# EAGLE design Main_backup1 (EAGLE 7.2.0)
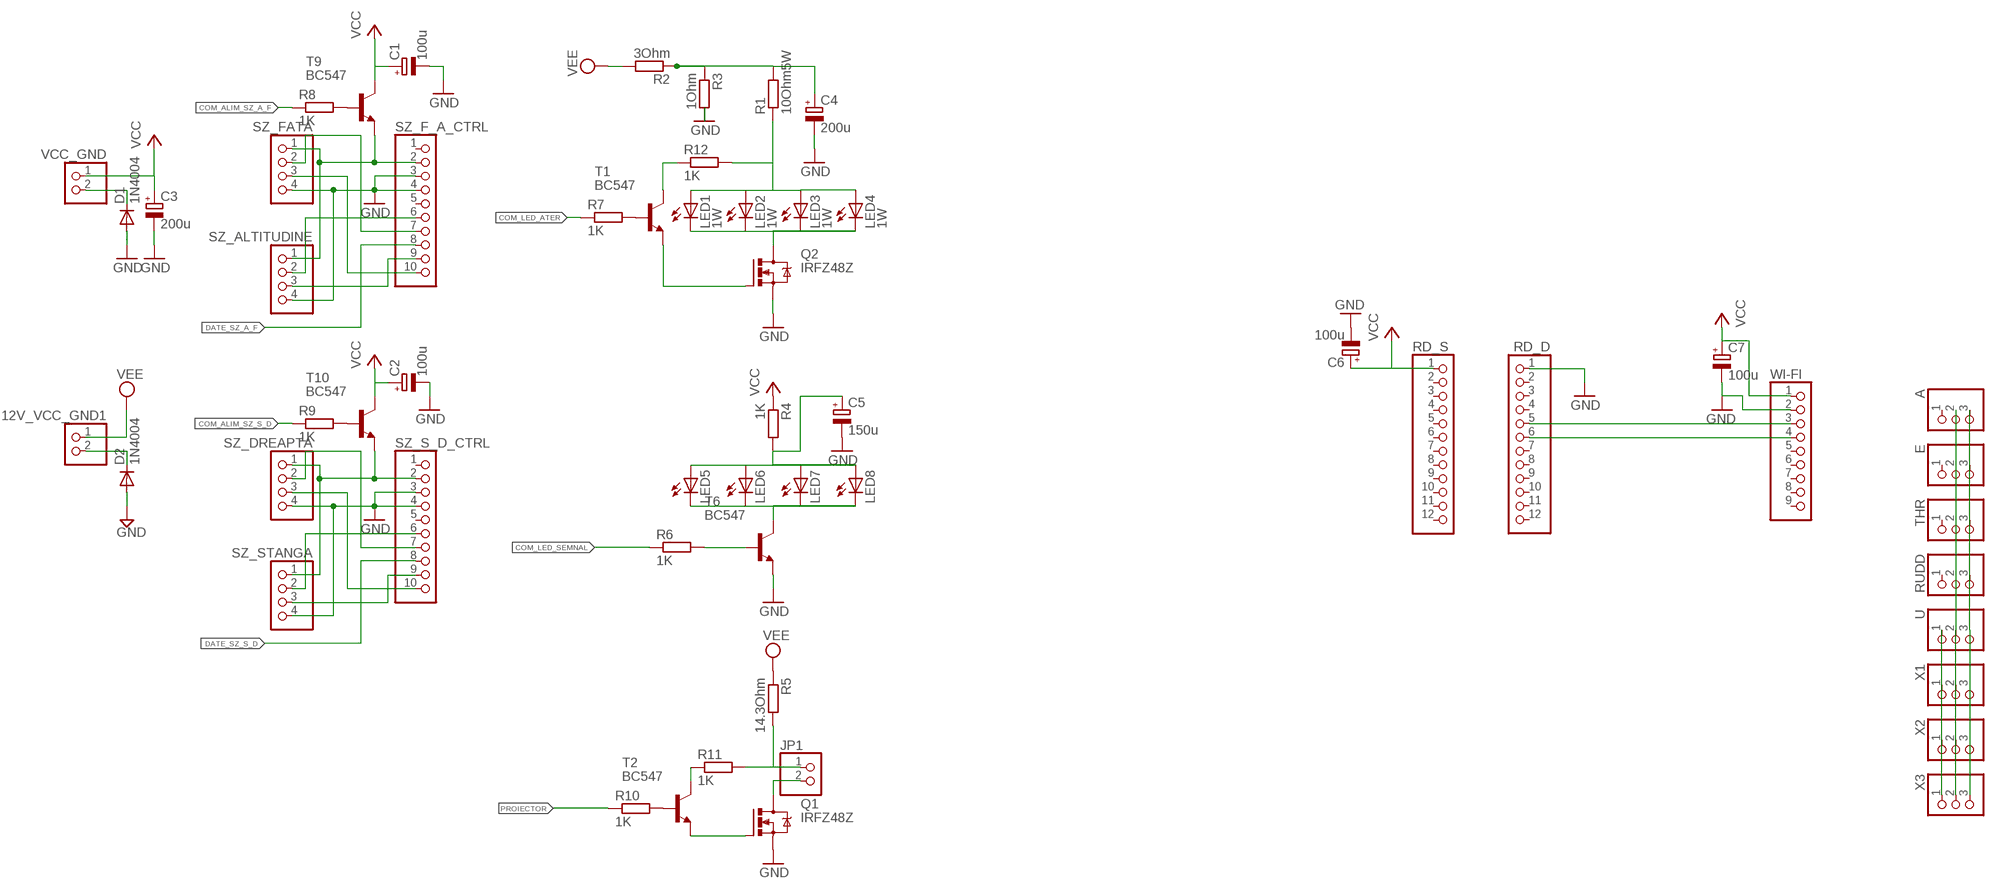
[diagram p0: schematic, sheet 1]

## Parts
12V_VCC_GND1  PINHD-1X2  [1X02]
A  PINHD-1X3/90  [1X03/90]
C1  100u  CPOL-EUE2-5  [E2-5]
C2  100u  CPOL-EUE2-5  [E2-5]
C3  200u  CPOL-EUE2-5  [E2-5]
C4  200u  CPOL-EUE2-5  [E2-5]
C5  150u  CPOL-EUE2-5  [E2-5]
C6  100u  CPOL-EUE2-5  [E2-5]
C7  100u  CPOL-EUE2-5  [E2-5]
D1  1N4004  [DO41-10]
D2  1N4004  [DO41-10]
E  PINHD-1X3/90  [1X03/90]
JP1  PINHD-1X2  [1X02]
LED1  1W  LEDSIDELED  [OSRAM-SIDELED]
LED2  1W  LEDSIDELED  [OSRAM-SIDELED]
LED3  1W  LEDSIDELED  [OSRAM-SIDELED]
LED4  1W  LEDSIDELED  [OSRAM-SIDELED]
LED5  LED5MM  [LED5MM]
LED6  LED5MM  [LED5MM]
LED7  LED5MM  [LED5MM]
LED8  LED5MM  [LED5MM]
Q1  IRFZ48Z  [TO220BH]
Q2  IRFZ48Z  [TO220BH]
R1  10Ohm5W  R-EU_0309/12  [0309/12]
R2  3Ohm  R-EU_0309/12  [0309/12]
R3  1Ohm  R-EU_0309/12  [0309/12]
R4  1K  R-EU_0309/12  [0309/12]
R5  14.3Ohm  R-EU_0309/12  [0309/12]
R6  1K  R-EU_0309/12  [0309/12]
R7  1K  R-EU_0309/12  [0309/12]
R8  1K  R-EU_0309/12  [0309/12]
R9  1K  R-EU_0309/12  [0309/12]
R10  1K  R-EU_0309/12  [0309/12]
R11  1K  R-EU_0309/12  [0309/12]
R12  1K  R-EU_0309/12  [0309/12]
RD_D  PINHD-1X12  [1X12]
RD_S  PINHD-1X12  [1X12]
RUDD  PINHD-1X3/90  [1X03/90]
SZ_ALTITUDINE  PINHD-1X4  [1X04]
SZ_DREAPTA  PINHD-1X4  [1X04]
SZ_F_A_CTRL  PINHD-1X10  [1X10]
SZ_FATA  PINHD-1X4  [1X04]
SZ_S_D_CTRL  PINHD-1X10  [1X10]
SZ_STANGA  PINHD-1X4  [1X04]
T1  BC547  [TO92]
T2  BC547  [TO92]
T6  BC547  [TO92]
T9  BC547  [TO92]
T10  BC547  [TO92]
THR  PINHD-1X3/90  [1X03/90]
U  PINHD-1X3/90  [1X03/90]
VCC_GND  PINHD-1X2  [1X02]
WI-FI  PINHD-1X9  [1X09]
X1  PINHD-1X3/90  [1X03/90]
X2  PINHD-1X3/90  [1X03/90]
X3  PINHD-1X3/90  [1X03/90]

## Nets
COM_ALIM_SZ_A_F: R8.1
COM_ALIM_SZ_S_D: R9.1
COM_LED_ATER: R7.1
COM_LED_SEMNAL: R6.1
DATE_SZ_A_F: SZ_F_A_CTRL.8
DATE_SZ_S_D: SZ_S_D_CTRL.8
GND: C1.- C2.- C3.- C4.- C5.- C6.- C7.- D1.A D2.A Q1.S Q2.S R3.2 RD_D.1 SZ_ALTITUDINE.4 SZ_DREAPTA.4 SZ_F_A_CTRL.3 SZ_F_A_CTRL.4 SZ_FATA.4 SZ_S_D_CTRL.3 SZ_S_D_CTRL.4 SZ_STANGA.4 T6.1(E) WI-FI.2
N$1: SZ_F_A_CTRL.7 SZ_FATA.2
N$2: D1.C VCC_GND.2
N$3: JP1.1 R5.2 R11.2
N$5: SZ_F_A_CTRL.10 SZ_FATA.3
N$6: SZ_ALTITUDINE.2 SZ_F_A_CTRL.6
N$7: SZ_ALTITUDINE.3 SZ_F_A_CTRL.9
N$8: SZ_DREAPTA.2 SZ_S_D_CTRL.7
N$9: SZ_DREAPTA.3 SZ_S_D_CTRL.10
N$10: SZ_S_D_CTRL.6 SZ_STANGA.2
N$11: SZ_S_D_CTRL.9 SZ_STANGA.3
N$12: SZ_ALTITUDINE.1 SZ_F_A_CTRL.2 SZ_FATA.1 T9.1(E)
N$13: SZ_DREAPTA.1 SZ_S_D_CTRL.2 SZ_STANGA.1 T10.1(E)
N$14: LED1.C LED2.C LED3.C LED4.C Q2.D
N$15: LED1.A LED2.A LED3.A LED4.A R1.1 R12.2
N$16: Q2.G T1.1(E)
N$17: C4.+ R1.2 R2.1 R3.1
N$18: 12V_VCC_GND1.2 D2.C
N$19: LED5.K(C) LED6.K(C) LED7.K(C) LED8.K(C) T6.3(C)
N$20: C5.+ LED5.A LED6.A LED7.A LED8.A R4.2
N$21: JP1.2 Q1.D
N$22: R6.2 T6.2(B)
N$23: R7.2 T1.2(B)
N$24: R8.2 T9.2(B)
N$25: R9.2 T10.2(B)
N$26: R10.2 T2.2(B)
N$27: R12.1 T1.3(C)
N$28: R11.1 T2.3(C)
N$29: Q1.G T2.1(E)
N$35: U.1 X1.1 X2.1 X3.1
N$37: RD_D.5 WI-FI.3
N$38: RD_D.6 WI-FI.4
N$39: A.3 E.3 RUDD.3 THR.3 U.3 X1.3 X2.3 X3.3
N$40: A.2 E.2 RUDD.2 THR.2 U.2 X1.2 X2.2 X3.2
PROIECTOR: R10.1
VCC: C1.+ C2.+ C3.+ C6.+ C7.+ R4.1 RD_S.1 T9.3(C) T10.3(C) VCC_GND.1 WI-FI.1
VEE: 12V_VCC_GND1.1 R2.2 R5.1
Unconnected: A.1 E.1 RD_D.2 RD_D.3 RD_D.4 RD_D.7 RD_D.8 RD_D.9 RD_D.10 RD_D.11 RD_D.12 RD_S.2 RD_S.3 RD_S.4 RD_S.5 RD_S.6 RD_S.7 RD_S.8 RD_S.9 RD_S.10 RD_S.11 RD_S.12 RUDD.1 SZ_F_A_CTRL.1 SZ_F_A_CTRL.5 SZ_S_D_CTRL.1 SZ_S_D_CTRL.5 THR.1 WI-FI.5 WI-FI.6 WI-FI.7 WI-FI.8 WI-FI.9

## Library data of the parts
12V_VCC_GND1 JP1 VCC_GND = pinhead:PINHD-1X2: PIN HEADER
A E RUDD THR U X1-X3 = pinhead:PINHD-1X3: PIN HEADER
C1-C7 = resistor:CPOL-EU: POLARIZED CAPACITOR, European symbol
D1 D2 = diode:1N4004: DIODE general purpose rectifier, 1 A
LED1-LED8 = led:LED: LED OSRAM: - CHIPLED LG R971, LG N971, LY N971, LG Q971, LY Q971, LO R971, LY R971 LH N974, LH R974 LS Q976, LO Q976, LY Q976 LO Q996 - Hyper CHIPLED LW Q18S LB Q993, LB Q99A, LB R99A - SideLED LS A670, LO A670, LY A670, LG A670, LP A670 LB A673, LV A673, LT A673, LW A673 LH A674 LY A675 LS A676, LA A676, LO A676, LY A676, LW A676 LS A679, LY A679, LG A679 - Hyper Micro SIDELED® LS Y876, LA Y876, LO Y876, LY Y876 LT Y87S - SmartLED LW L88C, LW L88S LB L89C, LB L89S, LG L890 LS L89K, LO L89K, LY L89K LS L896, LA L896, LO L896, LY L896 - TOPLED LS T670, LO T670, LY T670, LG T670, LP T670 LSG T670, LSP T670, LSY T670, LOP T670, LYG T670 LG T671, LOG T671, LSG T671 LB T673, LV T673, LT T673, LW T673 LH T674 LS T676, LA T676, LO T676, LY T676, LB T676, LH T676, LSB T676, LW T676 LB T67C, LV T67C, LT T67C, LS T67K, LO T67K, LY T67K, LW E67C LS E67B, LA E67B, LO E67B, LY E67B, LB E67C, LV E67C, LT E67C LW T67C LS T679, LY T679, LG T679 LS T770, LO T770, LY T770, LG T770, LP T770 LB T773, LV T773, LT T773, LW T773 LH T774 LS E675, LA E675, LY E675, LS T675 LS T776, LA T776, LO T776, LY T776, LB T776 LHGB T686 LT T68C, LB T68C - Hyper Mini TOPLED® LB M676 - Mini TOPLED Santana® LG M470 LS M47K, LO M47K, LY M47K Source: http://www.osram.convergy.de LUXEON: - LUMILED® LXK2-PW12-R00, LXK2-PW12-S00, LXK2-PW14-U00, LXK2-PW14-V00 LXK2-PM12-R00, LXK2-PM12-S00, LXK2-PM14-U00 LXK2-PE12-Q00, LXK2-PE12-R00, LXK2-PE12-S00, LXK2-PE14-T00, LXK2-PE14-U00 LXK2-PB12-K00, LXK2-PB12-L00, LXK2-PB12-M00, LXK2-PB14-N00, LXK2-PB14-P00, LXK2-PB14-Q00 LXK2-PR12-L00, LXK2-PR12-M00, LXK2-PR14-Q00, LXK2-PR14-R00 LXK2-PD12-Q00, LXK2-PD12-R00, LXK2-PD12-S00 LXK2-PH12-R00, LXK2-PH12-S00 LXK2-PL12-P00, LXK2-PL12-Q00, LXK2-PL12-R00 Source: www.luxeon.com KINGBRIGHT: KA-3528ASYC Source: www.kingbright.com
Q1 Q2 = transistor-power:IRFZ48: N Channel HEXFET® Power MOSFET Logic Level Source: http://www.irf.com/product-info/datasheets/data/irfz48z.pdf
R1-R12 = rcl:R-EU_: RESISTOR, European symbol
RD_D RD_S = pinhead:PINHD-1X12: PIN HEADER
SZ_ALTITUDINE SZ_DREAPTA SZ_FATA SZ_STANGA = pinhead:PINHD-1X4: PIN HEADER
SZ_F_A_CTRL SZ_S_D_CTRL = pinhead:PINHD-1X10: PIN HEADER
T1 T2 T6 T9 T10 = transistor:BC547: NPN TRANSISTOR
WI-FI = pinhead:PINHD-1X9: PIN HEADER

## Board
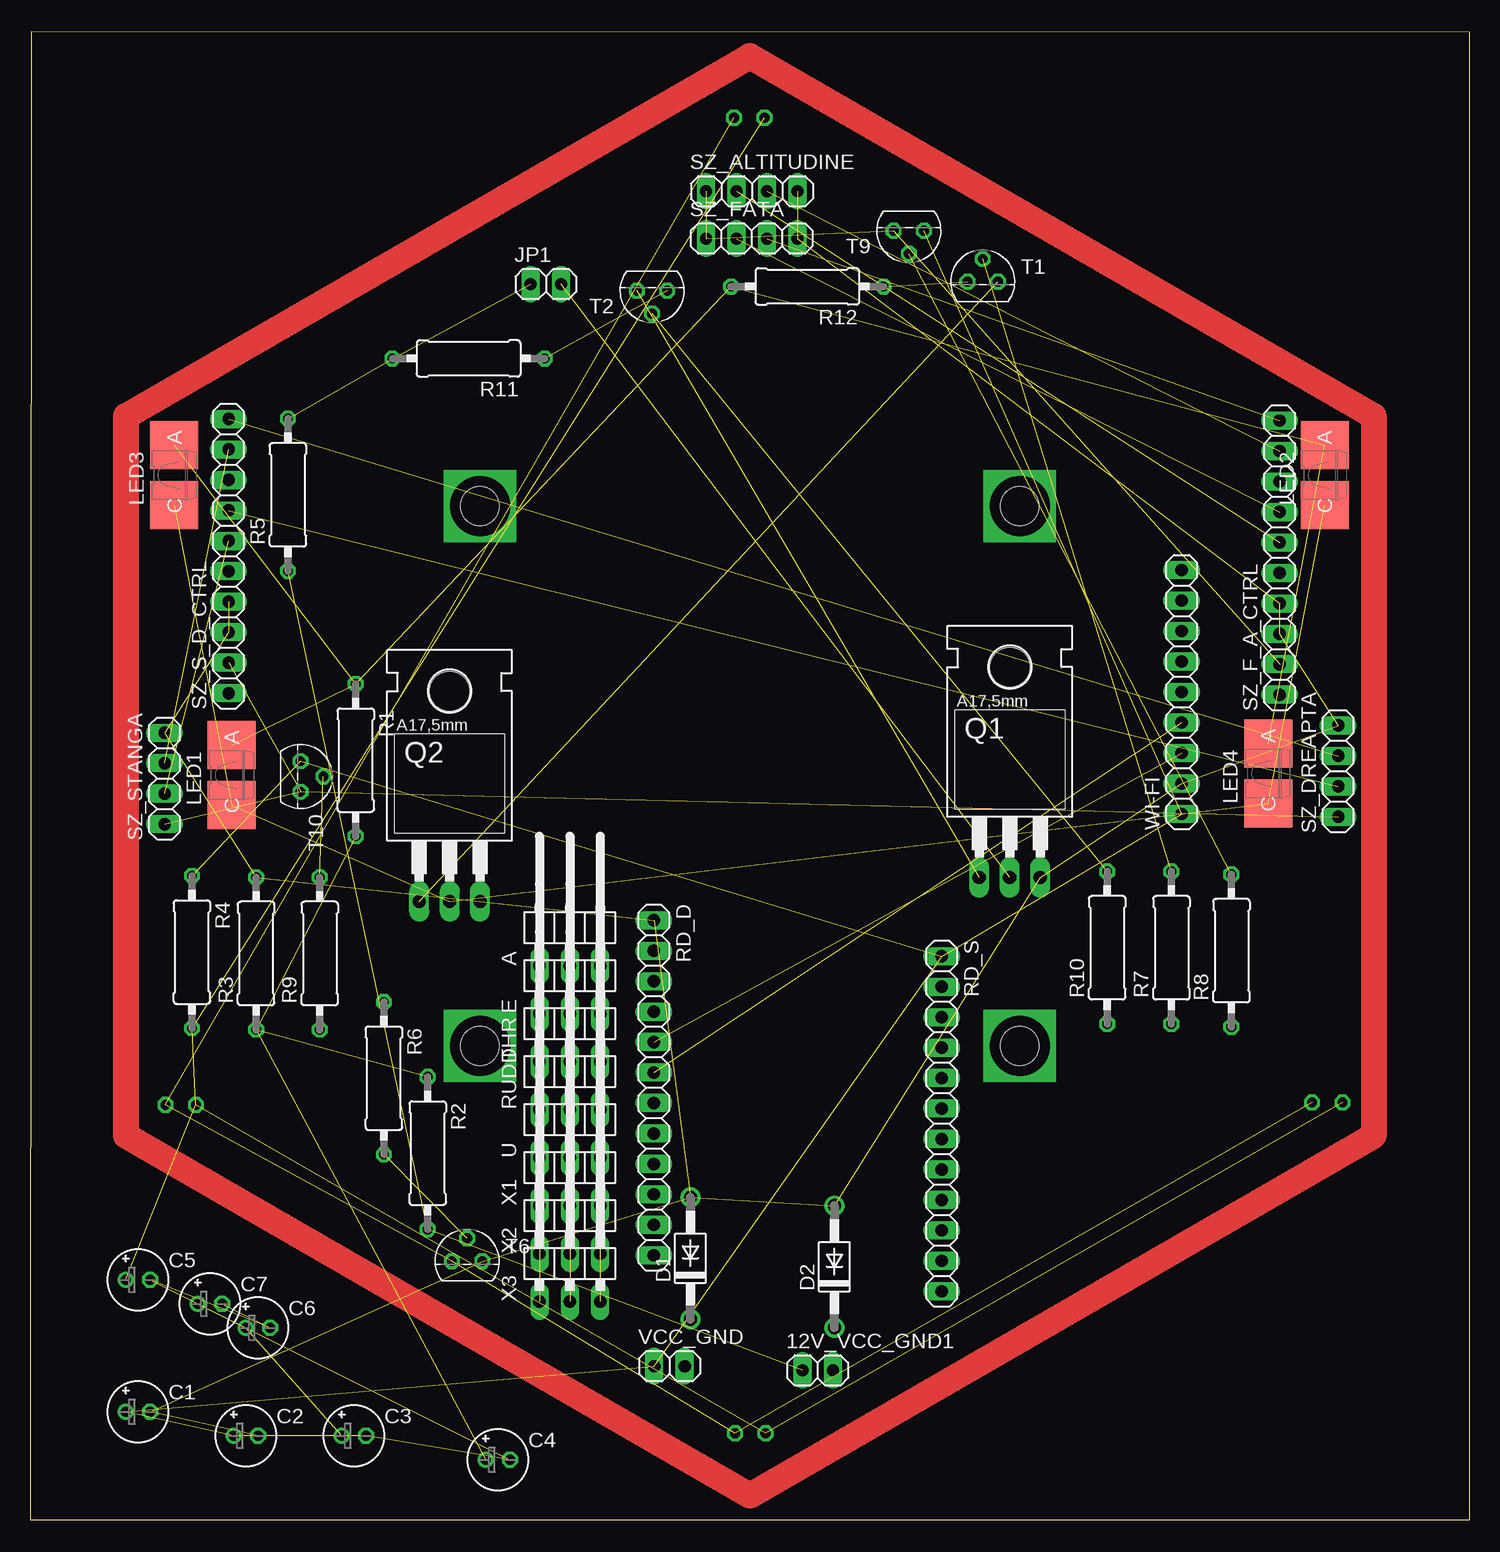
[diagram p1: board, top side]
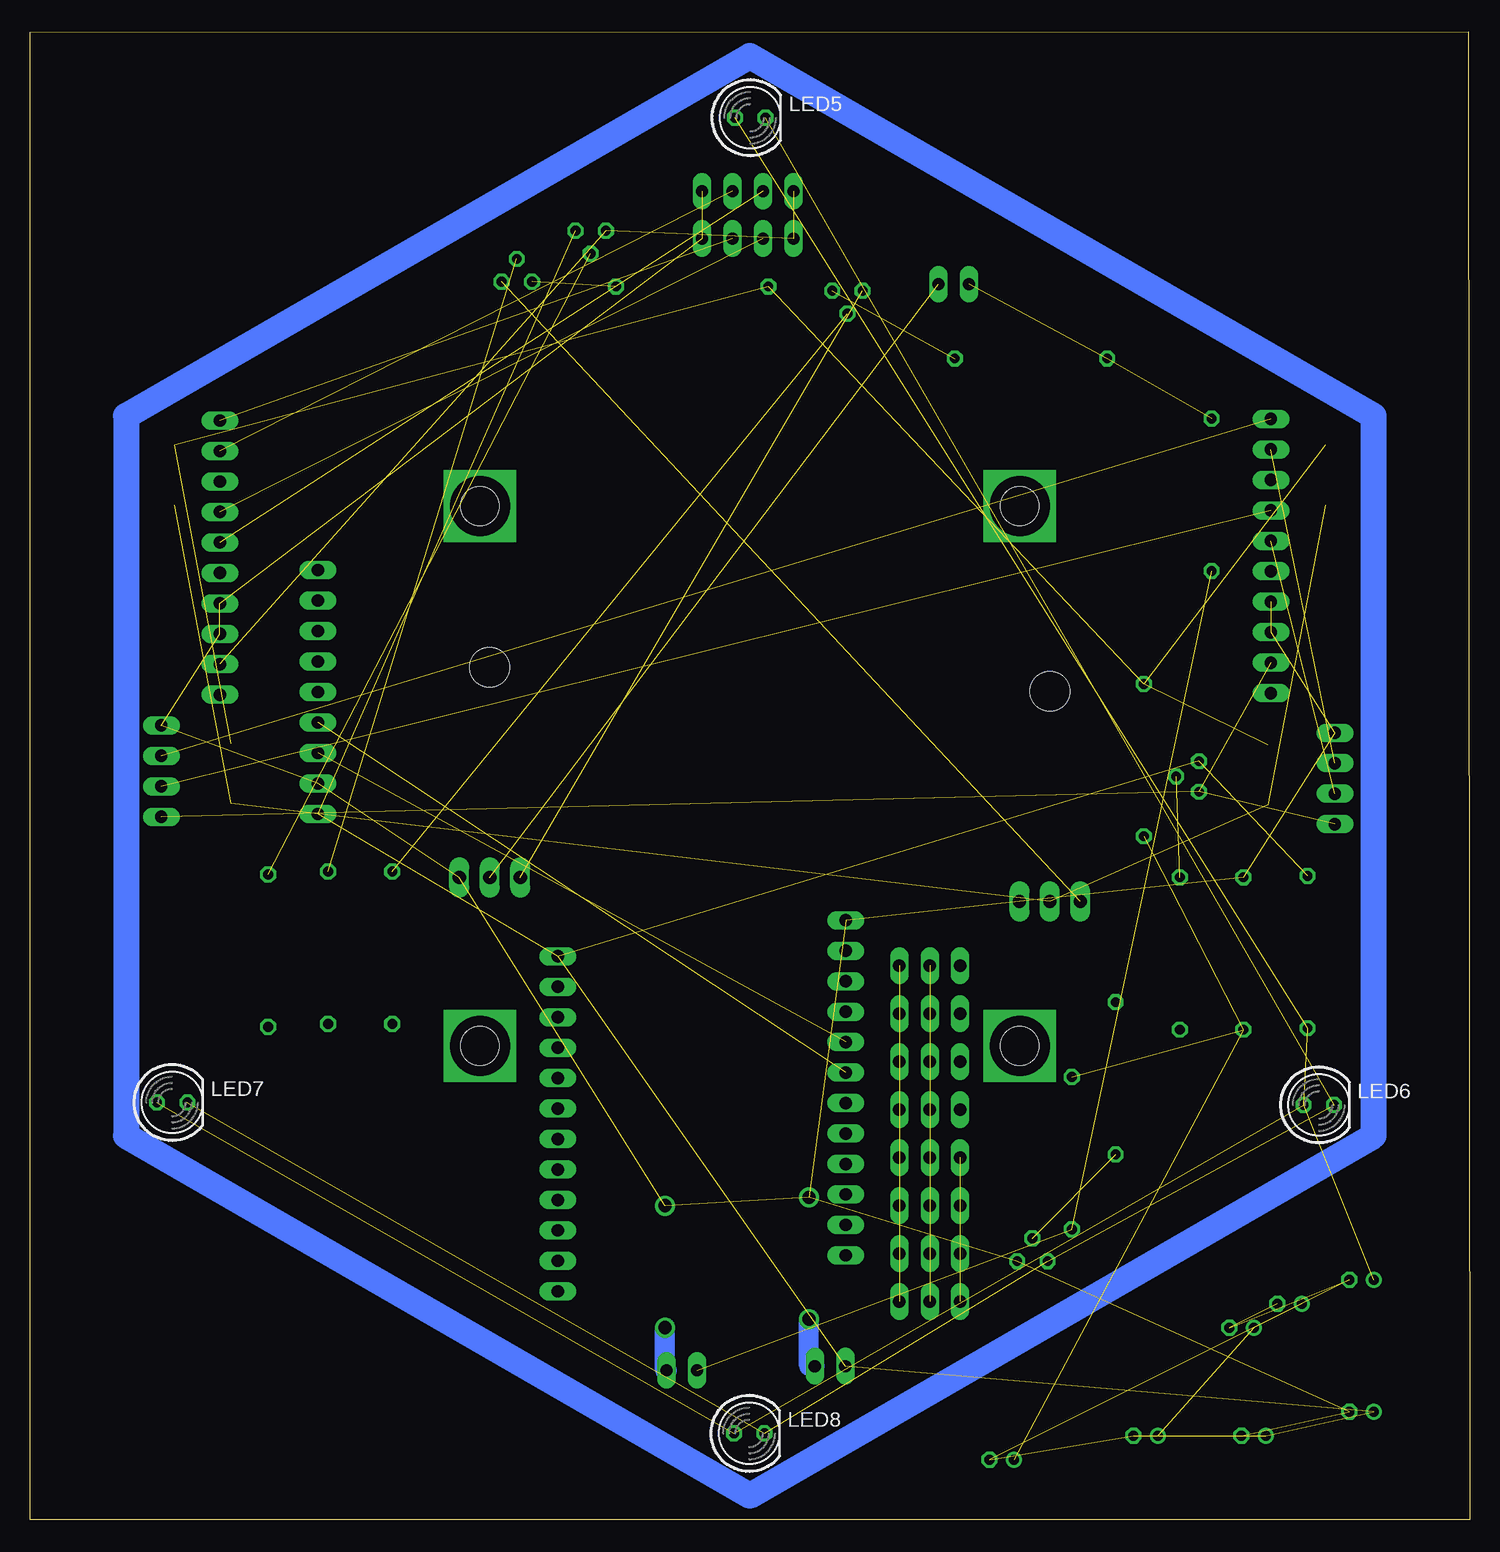
[diagram p2: board, bottom side, seen from below]

Size 120 x 124.03 mm. Coordinates in mm from the lower left corner, seen from the top.
Outline: 0,0 120,0 120,124 0.1,124.03 0,0
Copper layers (1*16): Top 0.035mm / dielectric 1.5mm / Bottom 0.035mm
Design rules "default": minimum track width 10mil, minimum drill 24mil, track to track 8mil, track to pad 8mil, pad to pad 8mil, via to via 8mil, smd to smd 8mil, copper to edge 40mil, drill to drill 8mil, minimum pad ring 10mil, minimum via ring 8mil, stop-mask expansion 4mil, vias tented up to drill 0mil, thermal gap 10mil
Holes 3.2 mm at 82.5,84.5 37.5,84.5 37.5,39.5 82.5,39.5

### Footprints (pad centres in the part's own frame; a part is rotated, then mirrored left to right if it is on the bottom)
1X02 = drill 1.016 long: 1 -1.27,0; 2 1.27,0
1X03/90 = drill 1.016 long: 1 -2.54,-3.81; 2 0,-3.81; 3 2.54,-3.81
E2-5 = drill 0.813 pad 1.27: + -1.016,0 | drill 0.813 pad 1.27 octagon: - 1.016,0
DO41-10 = drill 1.118: A 5.08,0; C -5.08,0
OSRAM-SIDELED = smd 4 x 4: A 0,2.5; C 0,-2.5
LED5MM = drill 0.813 octagon: A -1.27,0; K 1.27,0
TO220BH = drill 1.118 long: D 0,-6.35; G -2.54,-6.35; S 2.54,-6.35 | hole 3.302: 0,11.176
0309/12 = drill 0.813 octagon: 1 -6.35,0; 2 6.35,0
1X12 = drill 1.016 long: 1 -13.97,0; 2 -11.43,0; 3 -8.89,0; 4 -6.35,0; 5 -3.81,0; 6 -1.27,0; 7 1.27,0; 8 3.81,0; 9 6.35,0; 10 8.89,0; 11 11.43,0; 12 13.97,0
1X04 = drill 1.016 long: 1 -3.81,0; 2 -1.27,0; 3 1.27,0; 4 3.81,0
1X10 = drill 1.016 long: 1 -11.43,0; 2 -8.89,0; 3 -6.35,0; 4 -3.81,0; 5 -1.27,0; 6 1.27,0; 7 3.81,0; 8 6.35,0; 9 8.89,0; 10 11.43,0
TO92 = drill 0.813 octagon: 1 1.27,0; 2 0,1.905; 3 -1.27,0
1X09 = drill 1.016 long: 1 -10.16,0; 2 -7.62,0; 3 -5.08,0; 4 -2.54,0; 5 0,0; 6 2.54,0; 7 5.08,0; 8 7.62,0; 9 10.16,0

### Placement (x,y rotation side)
12V_VCC_GND1  65.66,12.45 0 top
A  45,50 0 top
C1  9,9 0 top
C2  18,7 0 top
C3  27,7 0 top
C4  39,5 0 top
C5  9,20 0 top
C6  19,16 0 top
C7  15,18 0 top
D1  55.06,21.79 90 top
D2  67.06,21.09 90 top
E  45,46 0 top
JP1  43,103 0 top
LED1  16.82,62.08 0 top
LED2  107.93,87.08 0 top
LED3  12.04,87.08 0 top
LED4  103.22,62.21 0 top
LED5  59.96,116.87 0 bottom
LED6  12.56,34.58 0 bottom
LED7  108.15,34.78 0 bottom
LED8  60.05,7.2 0 bottom
Q1  81.68,59.89 0 top
Q2  34.98,57.89 0 top
R1  27.15,63.32 270 top
R2  33.15,30.56 270 top
R3  18.85,47.2 90 top
R4  13.5,47.32 270 top
R5  21.5,85.44 90 top
R6  29.5,36.8 270 top
R7  95.15,47.68 90 top
R8  100.15,47.44 90 top
R9  24.15,47.2 90 top
R10  89.8,47.68 90 top
R11  36.56,96.8 180 top
R12  64.8,102.8 180 top
RD_D  52,36 270 top
RD_S  76,33 270 top
RUDD  45,38 0 top
SZ_ALTITUDINE  60.17,110.74 0 top
SZ_DREAPTA  109.05,62.41 90 top
SZ_F_A_CTRL  104.17,80.2 90 top
SZ_FATA  60.16,106.8 0 top
SZ_S_D_CTRL  16.55,80.33 90 top
SZ_STANGA  11.22,61.79 90 top
T1  79.42,103.2 0 top
T2  51.86,102.45 180 top
T6  36.44,21.55 0 top
T9  73.26,107.45 180 top
T10  22.55,61.96 270 top
THR  45,42 0 top
U  45,34 0 top
VCC_GND  53.31,12.8 0 top
WI-FI  96,69 90 top
X1  45,30 0 top
X2  45,26 0 top
X3  45,22 0 top

### Tracks (layer width: path | path; a pad name or v marks a point on that pad's centre or on a via)
GND  (22 unrouted)
N$1  (1 unrouted)
N$2
  Bottom 1.676: VCC_GND.2 55.06,12.8 D1.C
N$3  (2 unrouted)
N$4  (via drill 5)
  other vias: 82.5,39.5
N$5  (1 unrouted)
N$6  (1 unrouted)
N$7  (1 unrouted)
N$8  (1 unrouted)
N$9  (1 unrouted)
N$10  (1 unrouted)
N$11  (1 unrouted)
N$12  (3 unrouted)
N$13  (3 unrouted)
N$14  (4 unrouted)
N$15  (5 unrouted)
N$16  (1 unrouted)
N$17  (3 unrouted)
N$18
  Bottom 1.676: 12V_VCC_GND1.2 67.06,12.45 D2.C
N$19  (4 unrouted)
N$20  (5 unrouted)
N$21  (1 unrouted)
N$22  (1 unrouted)
N$23  (1 unrouted)
N$24  (1 unrouted)
N$25  (1 unrouted)
N$26  (1 unrouted)
N$27  (1 unrouted)
N$28  (1 unrouted)
N$29  (1 unrouted)
N$30  (via drill 5)
  other vias: 37.5,39.5
N$31
  Top 2.184: 60,122 112,92 112,32 60,2 8,32 8,92 60,122
N$32
  Bottom 2.184: 60,122 112,92 112,32 60,2 8,32 8,92 60,122
N$33  (via drill 5)
  other vias: 82.5,84.5
N$34  (via drill 5)
  other vias: 37.5,84.5
N$35  (3 unrouted)
N$37  (1 unrouted)
N$38  (1 unrouted)
N$39  (7 unrouted)
N$40  (7 unrouted)
VCC  (10 unrouted)
VEE  (2 unrouted)